# Altium schematic sheet Frame_Work.SchDoc
size A3
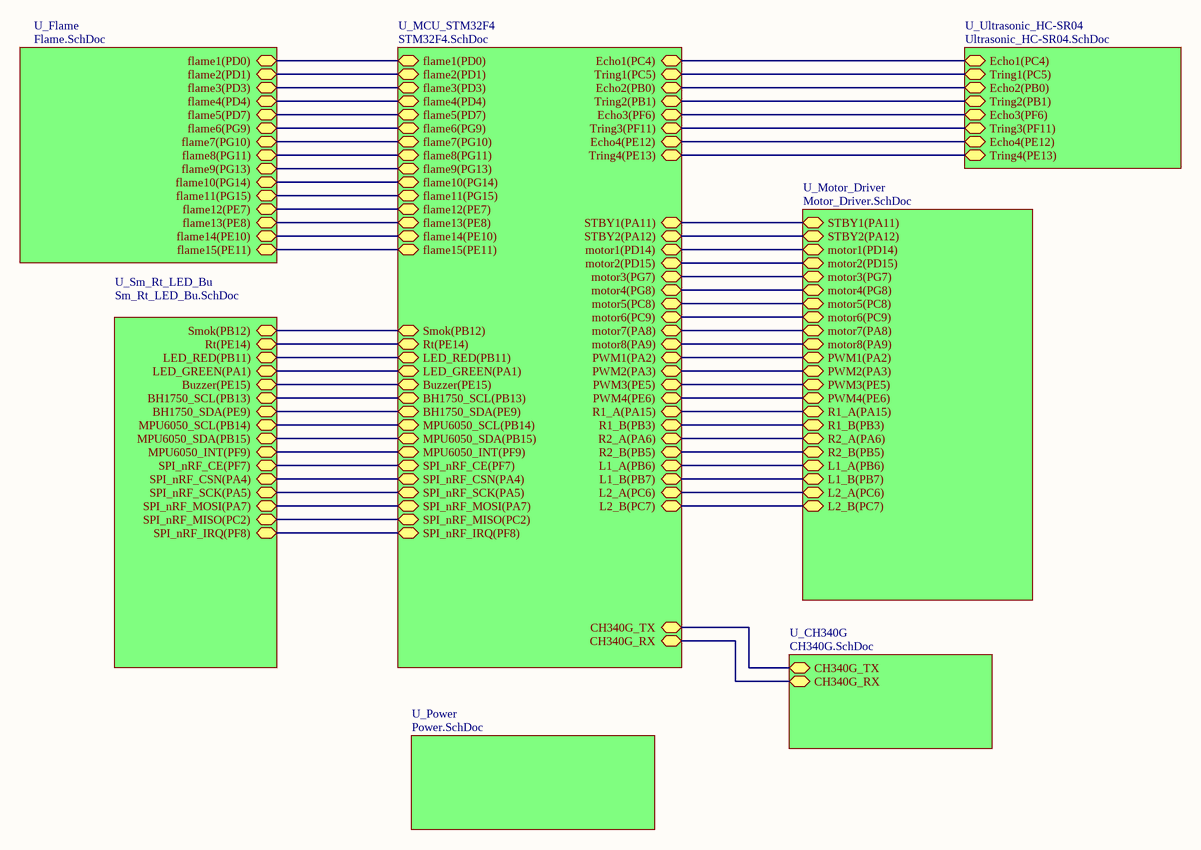
[diagram p0: Frame_Work.SchDoc]

## Sub-sheets
U_CH340G = CH340G.SchDoc: CH340G_TX (bidir), CH340G_RX (bidir)
U_Flame = Flame.SchDoc: flame1(PD0) (bidir), flame2(PD1) (bidir), flame3(PD3) (bidir), flame4(PD4) (bidir), flame5(PD7) (bidir), flame6(PG9) (bidir), flame7(PG10) (bidir), flame8(PG11) (bidir), flame9(PG13) (bidir), flame10(PG14) (bidir), flame11(PG15) (bidir), flame12(PE7) (bidir), flame13(PE8) (bidir), flame14(PE10) (bidir), flame15(PE11) (bidir)
U_MCU_STM32F4 = STM32F4.SchDoc: flame1(PD0) (bidir), flame2(PD1) (bidir), flame3(PD3) (bidir), flame4(PD4) (bidir), flame5(PD7) (bidir), flame6(PG9) (bidir), flame7(PG10) (bidir), flame8(PG11) (bidir), flame9(PG13) (bidir), flame10(PG14) (bidir), flame11(PG15) (bidir), flame12(PE7) (bidir), flame13(PE8) (bidir), flame14(PE10) (bidir), flame15(PE11) (bidir), Smok(PB12) (bidir), Rt(PE14) (bidir), LED_RED(PB11) (bidir), LED_GREEN(PA1) (bidir), Buzzer(PE15) (bidir), Echo1(PC4) (bidir), Tring1(PC5) (bidir), Echo2(PB0) (bidir), Tring2(PB1) (bidir), Echo3(PF6) (bidir), Tring3(PF11) (bidir), Echo4(PE12) (bidir), Tring4(PE13) (bidir), STBY1(PA11) (bidir), STBY2(PA12) (bidir), motor1(PD14) (bidir), motor2(PD15) (bidir), motor3(PG7) (bidir), motor4(PG8) (bidir), motor5(PC8) (bidir), motor6(PC9) (bidir), motor7(PA8) (bidir), motor8(PA9) (bidir), PWM1(PA2) (bidir), PWM2(PA3) (bidir), PWM3(PE5) (bidir), PWM4(PE6) (bidir), R1_A(PA15) (bidir), R1_B(PB3) (bidir), R2_A(PA6) (bidir), R2_B(PB5) (bidir), L1_A(PB6) (bidir), L1_B(PB7) (bidir), L2_A(PC6) (bidir), L2_B(PC7) (bidir), BH1750_SCL(PB13) (bidir), BH1750_SDA(PE9) (bidir), MPU6050_SCL(PB14) (bidir), MPU6050_SDA(PB15) (bidir), MPU6050_INT(PF9) (bidir), SPI_nRF_CE(PF7) (bidir), SPI_nRF_CSN(PA4) (bidir), SPI_nRF_SCK(PA5) (bidir), SPI_nRF_MOSI(PA7) (bidir), SPI_nRF_MISO(PC2) (bidir), SPI_nRF_IRQ(PF8) (bidir), CH340G_TX (bidir), CH340G_RX (bidir)
U_Motor_Driver = Motor_Driver.SchDoc: motor2(PD15) (bidir), motor1(PD14) (bidir), STBY2(PA12) (bidir), STBY1(PA11) (bidir), motor3(PG7) (bidir), motor4(PG8) (bidir), motor5(PC8) (bidir), motor6(PC9) (bidir), motor7(PA8) (bidir), motor8(PA9) (bidir), PWM1(PA2) (bidir), PWM2(PA3) (bidir), PWM3(PE5) (bidir), PWM4(PE6) (bidir), R1_A(PA15) (bidir), R1_B(PB3) (bidir), R2_A(PA6) (bidir), R2_B(PB5) (bidir), L1_A(PB6) (bidir), L1_B(PB7) (bidir), L2_A(PC6) (bidir), L2_B(PC7) (bidir)
U_Power = Power.SchDoc: no entries
U_Sm_Rt_LED_Bu = Sm_Rt_LED_Bu.SchDoc: Smok(PB12) (bidir), Rt(PE14) (bidir), LED_RED(PB11) (bidir), LED_GREEN(PA1) (bidir), Buzzer(PE15) (bidir), BH1750_SCL(PB13) (bidir), BH1750_SDA(PE9) (bidir), MPU6050_SCL(PB14) (bidir), MPU6050_SDA(PB15) (bidir), MPU6050_INT(PF9) (bidir), SPI_nRF_CE(PF7) (bidir), SPI_nRF_CSN(PA4) (bidir), SPI_nRF_SCK(PA5) (bidir), SPI_nRF_MOSI(PA7) (bidir), SPI_nRF_MISO(PC2) (bidir), SPI_nRF_IRQ(PF8) (bidir)
U_Ultrasonic_HC-SR04 = Ultrasonic_HC-SR04.SchDoc: Tring2(PB1) (bidir), Echo2(PB0) (bidir), Tring1(PC5) (bidir), Echo1(PC4) (bidir), Echo3(PF6) (bidir), Tring3(PF11) (bidir), Echo4(PE12) (bidir), Tring4(PE13) (bidir)

## Nets
(unnamed): sheet U_Flame/flame1(PD0), sheet U_MCU_STM32F4/flame1(PD0)
(unnamed): sheet U_Flame/flame2(PD1), sheet U_MCU_STM32F4/flame2(PD1)
(unnamed): sheet U_Flame/flame3(PD3), sheet U_MCU_STM32F4/flame3(PD3)
(unnamed): sheet U_Flame/flame4(PD4), sheet U_MCU_STM32F4/flame4(PD4)
(unnamed): sheet U_Flame/flame5(PD7), sheet U_MCU_STM32F4/flame5(PD7)
(unnamed): sheet U_Flame/flame6(PG9), sheet U_MCU_STM32F4/flame6(PG9)
(unnamed): sheet U_Flame/flame7(PG10), sheet U_MCU_STM32F4/flame7(PG10)
(unnamed): sheet U_Flame/flame8(PG11), sheet U_MCU_STM32F4/flame8(PG11)
(unnamed): sheet U_Flame/flame9(PG13), sheet U_MCU_STM32F4/flame9(PG13)
(unnamed): sheet U_Flame/flame10(PG14), sheet U_MCU_STM32F4/flame10(PG14)
(unnamed): sheet U_Flame/flame11(PG15), sheet U_MCU_STM32F4/flame11(PG15)
(unnamed): sheet U_Flame/flame12(PE7), sheet U_MCU_STM32F4/flame12(PE7)
(unnamed): sheet U_Flame/flame13(PE8), sheet U_MCU_STM32F4/flame13(PE8)
(unnamed): sheet U_Flame/flame14(PE10), sheet U_MCU_STM32F4/flame14(PE10)
(unnamed): sheet U_Flame/flame15(PE11), sheet U_MCU_STM32F4/flame15(PE11)
(unnamed): sheet U_MCU_STM32F4/Smok(PB12), sheet U_Sm_Rt_LED_Bu/Smok(PB12)
(unnamed): sheet U_MCU_STM32F4/Rt(PE14), sheet U_Sm_Rt_LED_Bu/Rt(PE14)
(unnamed): sheet U_MCU_STM32F4/LED_RED(PB11), sheet U_Sm_Rt_LED_Bu/LED_RED(PB11)
(unnamed): sheet U_MCU_STM32F4/LED_GREEN(PA1), sheet U_Sm_Rt_LED_Bu/LED_GREEN(PA1)
(unnamed): sheet U_MCU_STM32F4/Buzzer(PE15), sheet U_Sm_Rt_LED_Bu/Buzzer(PE15)
(unnamed): sheet U_MCU_STM32F4/Echo1(PC4), sheet U_Ultrasonic_HC-SR04/Echo1(PC4)
(unnamed): sheet U_MCU_STM32F4/Tring1(PC5), sheet U_Ultrasonic_HC-SR04/Tring1(PC5)
(unnamed): sheet U_MCU_STM32F4/Echo2(PB0), sheet U_Ultrasonic_HC-SR04/Echo2(PB0)
(unnamed): sheet U_MCU_STM32F4/Tring2(PB1), sheet U_Ultrasonic_HC-SR04/Tring2(PB1)
(unnamed): sheet U_MCU_STM32F4/Echo3(PF6), sheet U_Ultrasonic_HC-SR04/Echo3(PF6)
(unnamed): sheet U_MCU_STM32F4/Tring3(PF11), sheet U_Ultrasonic_HC-SR04/Tring3(PF11)
(unnamed): sheet U_MCU_STM32F4/Echo4(PE12), sheet U_Ultrasonic_HC-SR04/Echo4(PE12)
(unnamed): sheet U_MCU_STM32F4/Tring4(PE13), sheet U_Ultrasonic_HC-SR04/Tring4(PE13)
(unnamed): sheet U_MCU_STM32F4/STBY1(PA11), sheet U_Motor_Driver/STBY1(PA11)
(unnamed): sheet U_MCU_STM32F4/STBY2(PA12), sheet U_Motor_Driver/STBY2(PA12)
(unnamed): sheet U_MCU_STM32F4/motor1(PD14), sheet U_Motor_Driver/motor1(PD14)
(unnamed): sheet U_MCU_STM32F4/motor2(PD15), sheet U_Motor_Driver/motor2(PD15)
(unnamed): sheet U_MCU_STM32F4/motor3(PG7), sheet U_Motor_Driver/motor3(PG7)
(unnamed): sheet U_MCU_STM32F4/motor4(PG8), sheet U_Motor_Driver/motor4(PG8)
(unnamed): sheet U_MCU_STM32F4/motor5(PC8), sheet U_Motor_Driver/motor5(PC8)
(unnamed): sheet U_MCU_STM32F4/motor6(PC9), sheet U_Motor_Driver/motor6(PC9)
(unnamed): sheet U_MCU_STM32F4/motor7(PA8), sheet U_Motor_Driver/motor7(PA8)
(unnamed): sheet U_MCU_STM32F4/motor8(PA9), sheet U_Motor_Driver/motor8(PA9)
(unnamed): sheet U_MCU_STM32F4/PWM1(PA2), sheet U_Motor_Driver/PWM1(PA2)
(unnamed): sheet U_MCU_STM32F4/PWM2(PA3), sheet U_Motor_Driver/PWM2(PA3)
(unnamed): sheet U_MCU_STM32F4/PWM3(PE5), sheet U_Motor_Driver/PWM3(PE5)
(unnamed): sheet U_MCU_STM32F4/PWM4(PE6), sheet U_Motor_Driver/PWM4(PE6)
(unnamed): sheet U_MCU_STM32F4/R1_A(PA15), sheet U_Motor_Driver/R1_A(PA15)
(unnamed): sheet U_MCU_STM32F4/R1_B(PB3), sheet U_Motor_Driver/R1_B(PB3)
(unnamed): sheet U_MCU_STM32F4/R2_A(PA6), sheet U_Motor_Driver/R2_A(PA6)
(unnamed): sheet U_MCU_STM32F4/R2_B(PB5), sheet U_Motor_Driver/R2_B(PB5)
(unnamed): sheet U_MCU_STM32F4/L1_A(PB6), sheet U_Motor_Driver/L1_A(PB6)
(unnamed): sheet U_MCU_STM32F4/L1_B(PB7), sheet U_Motor_Driver/L1_B(PB7)
(unnamed): sheet U_MCU_STM32F4/L2_A(PC6), sheet U_Motor_Driver/L2_A(PC6)
(unnamed): sheet U_MCU_STM32F4/L2_B(PC7), sheet U_Motor_Driver/L2_B(PC7)
(unnamed): sheet U_MCU_STM32F4/BH1750_SCL(PB13), sheet U_Sm_Rt_LED_Bu/BH1750_SCL(PB13)
(unnamed): sheet U_MCU_STM32F4/BH1750_SDA(PE9), sheet U_Sm_Rt_LED_Bu/BH1750_SDA(PE9)
(unnamed): sheet U_MCU_STM32F4/MPU6050_SCL(PB14), sheet U_Sm_Rt_LED_Bu/MPU6050_SCL(PB14)
(unnamed): sheet U_MCU_STM32F4/MPU6050_SDA(PB15), sheet U_Sm_Rt_LED_Bu/MPU6050_SDA(PB15)
(unnamed): sheet U_MCU_STM32F4/MPU6050_INT(PF9), sheet U_Sm_Rt_LED_Bu/MPU6050_INT(PF9)
(unnamed): sheet U_MCU_STM32F4/SPI_nRF_CE(PF7), sheet U_Sm_Rt_LED_Bu/SPI_nRF_CE(PF7)
(unnamed): sheet U_MCU_STM32F4/SPI_nRF_CSN(PA4), sheet U_Sm_Rt_LED_Bu/SPI_nRF_CSN(PA4)
(unnamed): sheet U_MCU_STM32F4/SPI_nRF_SCK(PA5), sheet U_Sm_Rt_LED_Bu/SPI_nRF_SCK(PA5)
(unnamed): sheet U_MCU_STM32F4/SPI_nRF_MOSI(PA7), sheet U_Sm_Rt_LED_Bu/SPI_nRF_MOSI(PA7)
(unnamed): sheet U_MCU_STM32F4/SPI_nRF_MISO(PC2), sheet U_Sm_Rt_LED_Bu/SPI_nRF_MISO(PC2)
(unnamed): sheet U_MCU_STM32F4/SPI_nRF_IRQ(PF8), sheet U_Sm_Rt_LED_Bu/SPI_nRF_IRQ(PF8)
(unnamed): sheet U_MCU_STM32F4/CH340G_TX, sheet U_CH340G/CH340G_TX
(unnamed): sheet U_MCU_STM32F4/CH340G_RX, sheet U_CH340G/CH340G_RX